# EAGLE schematic ds2 (EAGLE 8.5.1)
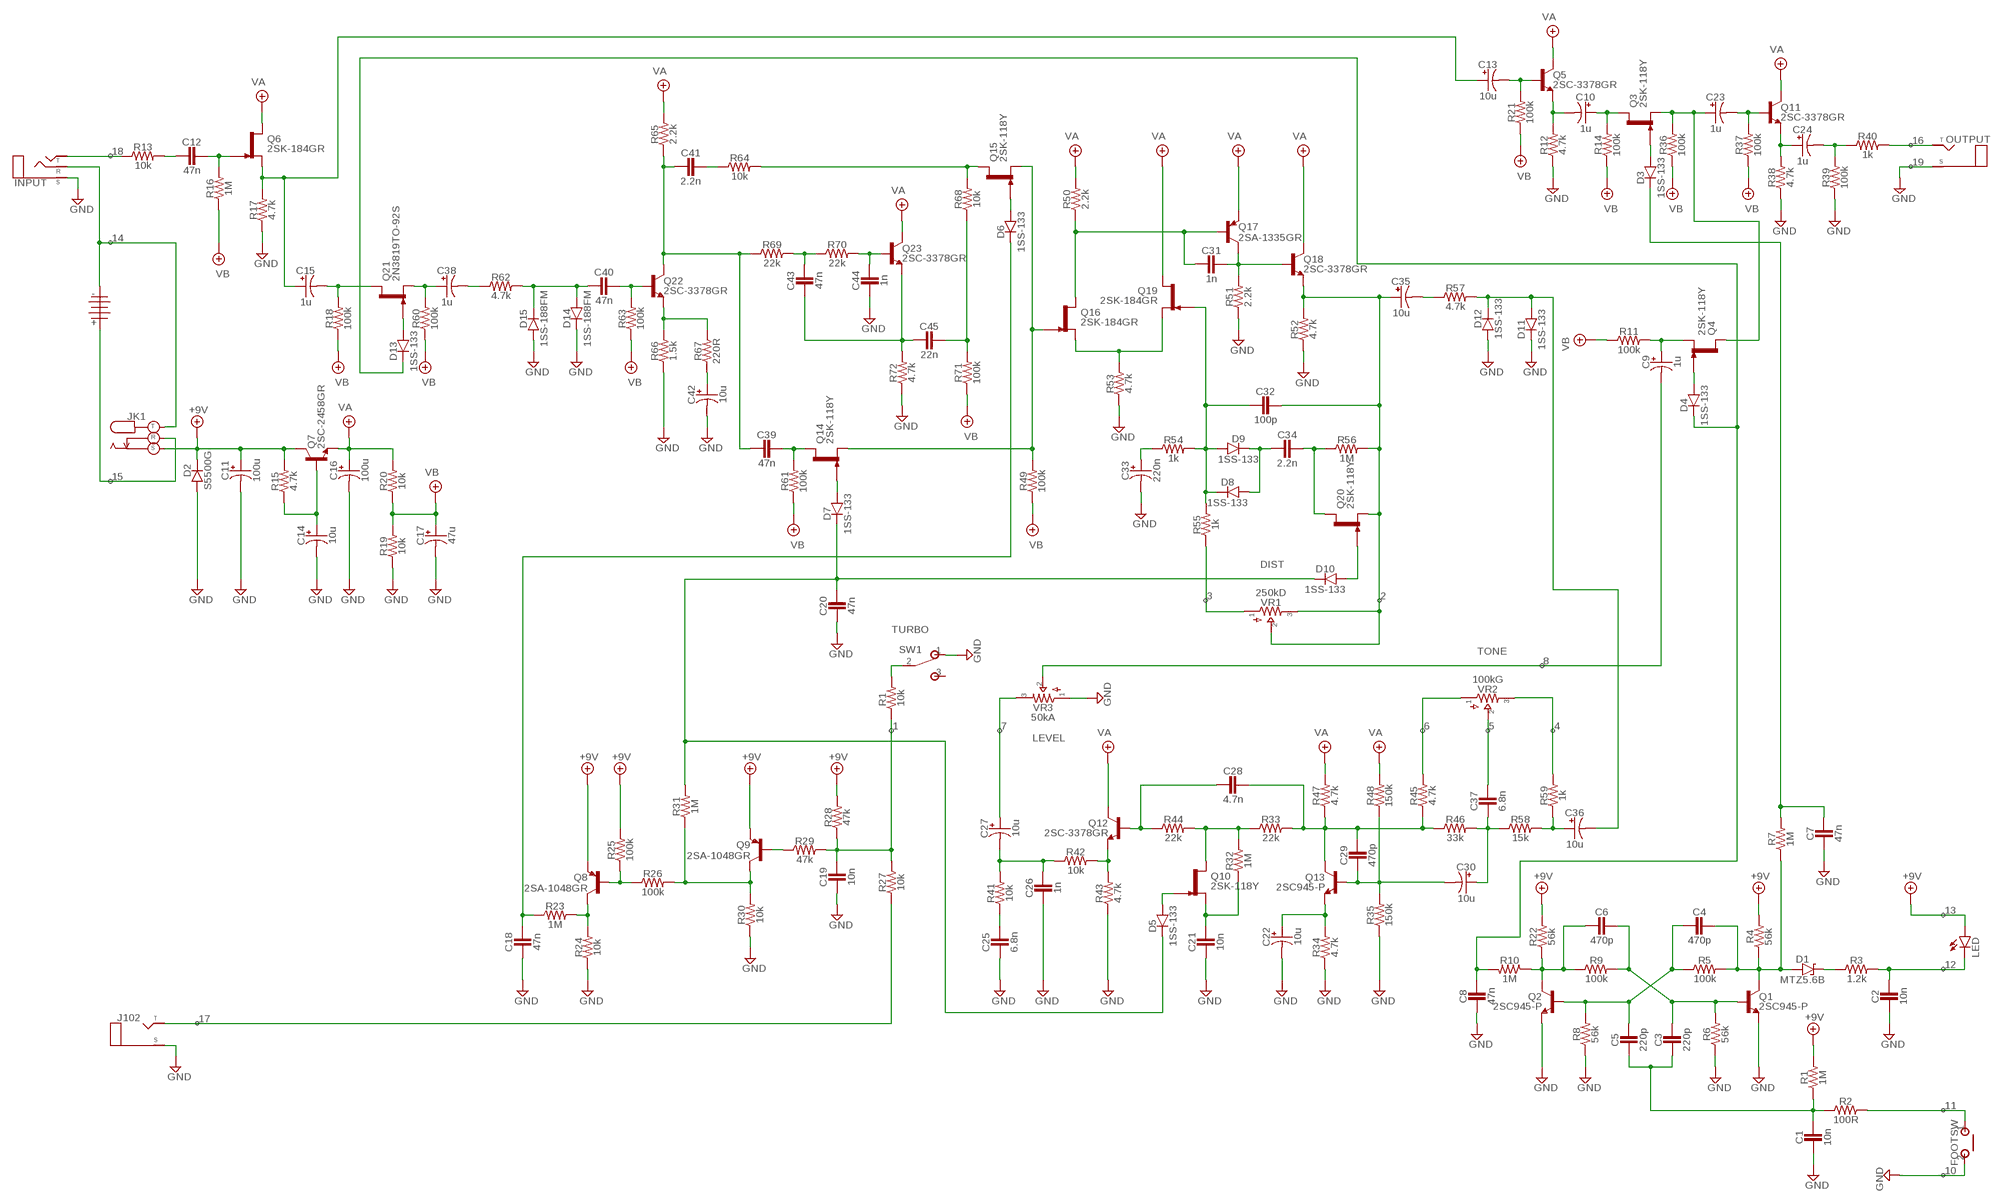
[diagram p0: schematic, sheet 1]

## Parts
1101  BATTERY  [TWO_PADS]
C1  10n  CER/FILMBOX.1  [BOX_SMALL]
C2  10n  CER/FILMBOX.1  [BOX_SMALL]
C3  220p  CER/FILMBOX.1  [BOX_SMALL]
C4  470p  CER/FILMBOX.1  [BOX_SMALL]
C5  220p  CER/FILMBOX.1  [BOX_SMALL]
C6  470p  CER/FILMBOX.1  [BOX_SMALL]
C7  47n  CER/FILMBOX.1  [BOX_SMALL]
C8  47n  CER/FILMBOX.1  [BOX_SMALL]
C9  1u  0400  [040_020]
C10  1u  0400  [040_020]
C11  100u  0400  [040_020]
C12  47n  CER/FILMBOX.1  [BOX_SMALL]
C13  10u  0400  [040_020]
C14  10u  0400  [040_020]
C15  1u  0400  [040_020]
C16  100u  0400  [040_020]
C17  47u  0400  [040_020]
C18  47n  CER/FILMBOX.1  [BOX_SMALL]
C19  10n  CER/FILMBOX.1  [BOX_SMALL]
C20  47n  CER/FILMBOX.1  [BOX_SMALL]
C21  10n  CER/FILMBOX.1  [BOX_SMALL]
C22  10u  0400  [040_020]
C23  1u  0400  [040_020]
C24  1u  0400  [040_020]
C25  6.8n  CER/FILMBOX.1  [BOX_SMALL]
C26  1n  CER/FILMBOX.1  [BOX_SMALL]
C27  10u  0400  [040_020]
C28  4.7n  CER/FILMBOX.1  [BOX_SMALL]
C29  470p  CER/FILMBOX.1  [BOX_SMALL]
C30  10u  0400  [040_020]
C31  1n  CER/FILMBOX.1  [BOX_SMALL]
C32  100p  CER/FILMBOX.1  [BOX_SMALL]
C33  220n  0400  [040_020]
C34  2.2n  CER/FILMBOX.1  [BOX_SMALL]
C35  10u  0400  [040_020]
C36  10u  0400  [040_020]
C37  6.8n  CER/FILMBOX.1  [BOX_SMALL]
C38  1u  0400  [040_020]
C39  47n  CER/FILMBOX.1  [BOX_SMALL]
C40  47n  CER/FILMBOX.1  [BOX_SMALL]
C41  2.2n  CER/FILMBOX.1  [BOX_SMALL]
C42  10u  0400  [040_020]
C43  47n  CER/FILMBOX.1  [BOX_SMALL]
C44  1n  CER/FILMBOX.1  [BOX_SMALL]
C45  22n  CER/FILMBOX.1  [BOX_SMALL]
D1  MTZ5.6B  ZENER.2  [DO41-2]
D2  S5500G  DO35.2  [DO35-2]
D3  1SS-133  DO35.2  [DO35-2]
D4  1SS-133  DO35.2  [DO35-2]
D5  1SS-133  DO35.2  [DO35-2]
D6  1SS-133  DO35.2  [DO35-2]
D7  1SS-133  DO35.2  [DO35-2]
D8  1SS-133  DO35.2  [DO35-2]
D9  1SS-133  DO35.2  [DO35-2]
D10  1SS-133  DO35.2  [DO35-2]
D11  1SS-133  DO35.2  [DO35-2]
D12  1SS-133  DO35.2  [DO35-2]
D13  1SS-133  DO35.2  [DO35-2]
D14  1SS-188FM  DO35.2  [DO35-2]
D15  1SS-188FM  DO35.2  [DO35-2]
FOOTSW  MOMENTARY  [SPST]
INPUT  STEREO3PADS  [THREEPADS]
J102  MONO  [TWO_PADS]
JK1  DC_KOBICONN  [DC_KOBICONN]
LED  LED  [3MM_D]
OUTPUT  MONO  [TWO_PADS]
Q1  2SC945-P  2SC828A  [TO92-]
Q2  2SC945-P  2SC828A  [TO92-]
Q3  2SK-118Y  2N3819TO-92S  [TO92-]
Q4  2SK-118Y  2N3819TO-92S  [TO92-]
Q5  2SC-3378GR  2SC828A  [TO92-]
Q6  2SK-184GR  2N3819TO-92S  [TO92-]
Q7  2SC-2458GR  2SC828A  [TO92-]
Q8  2SA-1048GR  2N3906-  [TO92-]
Q9  2SA-1048GR  2N3906-  [TO92-]
Q10  2SK-118Y  2N3819TO-92S  [TO92-]
Q11  2SC-3378GR  2SC828A  [TO92-]
Q12  2SC-3378GR  2SC828A  [TO92-]
Q13  2SC945-P  2SC828A  [TO92-]
Q14  2SK-118Y  2N3819TO-92S  [TO92-]
Q15  2SK-118Y  2N3819TO-92S  [TO92-]
Q16  2SK-184GR  2N3819TO-92S  [TO92-]
Q17  2SA-1335GR  2N3906-  [TO92-]
Q18  2SC-3378GR  2SC828A  [TO92-]
Q19  2SK-184GR  2N3819TO-92S  [TO92-]
Q20  2SK-118Y  2N3819TO-92S  [TO92-]
Q21  2N3819TO-92S  [TO92-]
Q22  2SC-3378GR  2SC828A  [TO92-]
Q23  2SC-3378GR  2SC828A  [TO92-]
R1  1M  R_.3B  [R0207/3]
R1   10k  R_.3B  [R0207/3]
R2  100R  R_.3B  [R0207/3]
R3  1.2k  R_.3B  [R0207/3]
R4  56k  R_.3B  [R0207/3]
R5  100k  R_.3B  [R0207/3]
R6  56k  R_.3B  [R0207/3]
R7  1M  R_.3B  [R0207/3]
R8  56k  R_.3B  [R0207/3]
R9  100k  R_.3B  [R0207/3]
R10  1M  R_.3B  [R0207/3]
R11  100k  R_.3B  [R0207/3]
R12  4.7k  R_.3B  [R0207/3]
R13  10k  R_.3B  [R0207/3]
R14  100k  R_.3B  [R0207/3]
R15  4.7k  R_.3B  [R0207/3]
R16  1M  R_.3B  [R0207/3]
R17  4.7k  R_.3B  [R0207/3]
R18  100k  R_.3B  [R0207/3]
R19  10k  R_.3B  [R0207/3]
R20  10k  R_.3B  [R0207/3]
R21  100k  R_.3B  [R0207/3]
R22  56k  R_.3B  [R0207/3]
R23  1M  R_.3B  [R0207/3]
R24  10k  R_.3B  [R0207/3]
R25  100k  R_.3B  [R0207/3]
R26  100k  R_.3B  [R0207/3]
R27  10k  R_.3B  [R0207/3]
R28  47k  R_.3B  [R0207/3]
R29  47k  R_.3B  [R0207/3]
R30  10k  R_.3B  [R0207/3]
R31  1M  R_.3B  [R0207/3]
R32  1M  R_.3B  [R0207/3]
R33  22k  R_.3B  [R0207/3]
R34  4.7k  R_.3B  [R0207/3]
R35  150k  R_.3B  [R0207/3]
R36  100k  R_.3B  [R0207/3]
R37  100k  R_.3B  [R0207/3]
R38  4.7k  R_.3B  [R0207/3]
R39  100k  R_.3B  [R0207/3]
R40  1k  R_.3B  [R0207/3]
R41  10k  R_.3B  [R0207/3]
R42  10k  R_.3B  [R0207/3]
R43  4.7k  R_.3B  [R0207/3]
R44  22k  R_.3B  [R0207/3]
R45  4.7k  R_.3B  [R0207/3]
R46  33k  R_.3B  [R0207/3]
R47  4.7k  R_.3B  [R0207/3]
R48  150k  R_.3B  [R0207/3]
R49  100k  R_.3B  [R0207/3]
R50  2.2k  R_.3B  [R0207/3]
R51  2.2k  R_.3B  [R0207/3]
R52  4.7k  R_.3B  [R0207/3]
R53  4.7k  R_.3B  [R0207/3]
R54  1k  R_.3B  [R0207/3]
R55  1k  R_.3B  [R0207/3]
R56  1M  R_.3B  [R0207/3]
R57  4.7k  R_.3B  [R0207/3]
R58  15k  R_.3B  [R0207/3]
R59  1k  R_.3B  [R0207/3]
R60  100k  R_.3B  [R0207/3]
R61  100k  R_.3B  [R0207/3]
R62  4.7k  R_.3B  [R0207/3]
R63  100k  R_.3B  [R0207/3]
R64  10k  R_.3B  [R0207/3]
R65  2.2k  R_.3B  [R0207/3]
R66  1.5k  R_.3B  [R0207/3]
R67  220R  R_.3B  [R0207/3]
R68  10k  R_.3B  [R0207/3]
R69  22k  R_.3B  [R0207/3]
R70  22k  R_.3B  [R0207/3]
R71  100k  R_.3B  [R0207/3]
R72  4.7k  R_.3B  [R0207/3]
SW1  SPDT  [M9040P]
VR1  250kD  POTS16MM  [16MM]
VR2  100kG  POTS16MM  [16MM]
VR3  50kA  POTS16MM  [16MM]

## Nets
+9V: C11.+ D2.C JK1.S LED.ANODE(A) Q7.2(C) Q8.3(E) Q9.3(E) R1.2 R4.2 R15.2 R22.2 R25.2 R28.2
GND: C1.2 C2.2 C7.2 C8.2 C11.- C14.- C16.- C17.- C18.2 C19.2 C20.2 C21.2 C22.- C25.2 C26.2 C33.- C42.- C44.2 D2.A D11.C D12.A D14.C D15.A FOOTSW.2(S) INPUT.SLEEVE(S) J102.S(SLEEVE) OUTPUT.S(SLEEVE) Q1.3(E) Q2.3(E) R6.1 R8.1 R12.1 R17.1 R19.1 R24.1 R30.1 R34.1 R35.1 R38.1 R39.1 R43.1 R51.1 R52.1 R53.1 R66.1 R72.1 SW1.1(O) VR3.1
N$1: INPUT.TIP(T) R13.1
N$2: 1101.S INPUT.RING(R) JK1.T
N$3: C35.- R57.1
N$4: C14.+ Q7.1(B) R15.1
N$5: D10.A Q20.2(G)
N$6: C36.- D11.A D12.C R57.2
N$7: C12.2 R13.2
N$8: C12.1 Q6.2(G) R16.2
N$9: C13.+ C15.+ Q6.1(S) R17.2
N$10: C15.- Q21.3(D) R18.2
N$11: D13.A Q21.2(G)
N$12: C38.+ Q21.1(S) R60.2
N$13: C38.- R62.1
N$14: C40.2 D14.A D15.C R62.2
N$15: C40.1 Q22.1(B) R63.2
N$16: Q22.3(E) R66.2 R67.2
N$17: C42.+ R67.1
N$18: C39.2 C41.2 Q22.2(C) R65.1 R69.1
N$19: C43.2 C45.2 Q23.3(E) R72.2
N$20: C43.1 R69.2 R70.1
N$21: C44.1 Q23.1(B) R70.2
N$22: C45.1 R68.1 R71.2
N$23: C41.1 R64.1
N$24: Q15.3(D) R64.2 R68.2
N$25: C39.1 Q14.3(D) R61.2
N$26: Q14.1(S) Q15.1(S) Q16.2(G) R49.2
N$27: 1101.T JK1.R
N$28: D6.A Q15.2(G)
N$29: C6.2 Q2.2(C) R9.1 R10.1 R22.1
N$30: D7.A Q14.2(G)
N$31: C4.1 D1.A Q1.2(C) R4.1 R5.2 R7.1
N$32: C4.2 C5.1 Q2.1(B) R5.1 R8.2
N$33: Q16.1(S) Q19.1(S) R53.2
N$34: C3.1 C6.1 Q1.1(B) R6.2 R9.2
N$35: C1.1 C3.2 C5.2 R1.1 R2.1
N$36: C8.1 D4.C D13.C R10.2
N$37: C9.+ Q4.1(S) R11.2
N$38: D4.A Q4.2(G)
N$39: C31.2 Q16.3(D) Q17.2(B) R50.1
N$40: C31.1 Q17.1(C) Q18.1(B) R51.2
N$41: C36.+ R58.2 R59.1
N$42: C13.- Q5.1(B) R21.2
N$43: C9.- VR3.2
N$44: C32.2 D8.C D9.A Q19.2(G) R54.2 R55.2
N$45: C34.2 D8.A D9.C
N$46: C30.+ C37.2 R46.2 R58.1
N$47: C7.1 D3.C R7.2
N$48: C23.+ Q3.1(S) Q4.3(D) R36.2
N$49: C10.- Q5.3(E) R12.2
N$50: C10.+ Q3.3(D) R14.2
N$51: C34.1 Q20.3(D) R56.1
N$52: C28.1 C29.1 Q13.2(C) R33.2 R45.1 R46.1 R47.1
N$53: C32.1 C35.+ Q18.3(E) Q20.1(S) R52.2 R56.2 VR1.2 VR1.3
N$54: D3.A Q3.2(G)
N$55: C33.+ R54.1
N$56: R55.1 VR1.1
N$57: R45.2 VR2.1
N$58: R59.2 VR2.3
N$59: C37.1 VR2.2
N$60: C29.2 C30.- Q13.1(B) R35.2 R48.1
N$61: D5.A Q10.2(G)
N$62: C22.+ Q13.3(E) R34.2
N$63: C28.2 Q12.1(B) R44.1
N$64: C21.1 Q10.1(S) R32.1
N$65: Q10.3(D) R32.2 R33.1 R44.2
N$66: Q12.3(E) R42.2 R43.2
N$67: C26.1 C27.- R41.2 R42.1
N$68: C25.1 R41.1
N$69: J102.T(TIP) R27.1
N$70: C27.+ VR3.3
N$71: Q9.2(B) R29.1
N$72: C20.1 D5.C D7.C D10.C R31.2
N$73: Q8.2(B) R25.1 R26.1
N$74: Q8.1(C) R23.2 R24.2
N$75: C18.1 D6.C R23.1
N$76: R1 .2 SW1.2(P)
N$77: C23.- Q11.1(B) R37.2
N$78: C24.+ Q11.3(E) R38.2
N$79: Q9.1(C) R26.2 R30.2 R31.1
N$80: C24.- R39.2 R40.1
N$81: OUTPUT.T(TIP) R40.2
N$82: D1.C R3.1
N$83: C2.1 LED.P$1(C) R3.2
N$84: FOOTSW.1(P) R2.2
N$85: C19.1 R1 .1 R27.2 R28.1 R29.2
VA: C16.+ Q5.2(C) Q6.3(D) Q7.3(E) Q11.2(C) Q12.2(C) Q17.3(E) Q18.2(C) Q19.3(D) Q23.2(C) R20.2 R47.2 R48.2 R50.2 R65.2
VB: C17.+ R11.1 R14.1 R16.1 R18.1 R19.2 R20.1 R21.1 R36.1 R37.1 R49.1 R60.1 R61.1 R63.1 R71.1
Unconnected: SW1.3(S)

## Notes on the sheet
- 16
- 18
- 19
- 14
- 15
- DIST
- 3 | 2
- TURBO
- TONE
- 8
- 1 | 7 | 6 | 5 | 4
- LEVEL
- 13
- 12
- 17
- 11
- 10

## Library data of the parts
1101 = pedals-jacks:BATTERY
C1-C8 C12 C18-C21 C25 C26 C28 C29 C31 C32 C34 C37 C39-C41 C43-C45 = pedals-capacitors-film:CER/FILM: 47 - 120pF Xicon Ceramic Disc 2.5mm lead spacing
C9-C11 C13-C17 C22-C24 C27 C30 C33 C35 C36 C38 C42 = pedals-capacitors-elec:040
D1 = pedals-diodes:ZENER
D2-D15 = pedals-diodes:DO35: DO-35 Package Diodes: 1N914
FOOTSW = pedals-switches:MOMENTARY
INPUT = pedals-jacks:STEREO
J102 OUTPUT = pedals-jacks:MONO: Mono 1/4" Phone Jack
JK1 = pedals-jacks:DC_KOBICONN
LED = pedals-diodes:LED
Q1 Q2 Q5 Q7 Q11-Q13 Q18 Q22 Q23 = pedals-transistors:2SC828A
Q3 Q4 Q6 Q10 Q14-Q16 Q19-Q21 = pedals-transistors:2N3819: N-CHANNEL FET
Q8 Q9 Q17 = pedals-transistors:2N3906: PNP Transistor
R1 R1  R2-R72 = pedals-resistors:R_
SW1 = pedals-switches:SPDT: TOGGLE SWITCH Marquardt
VR1-VR3 = pedals-potentiometers:POTS